# Altium schematic sheet raspi.SchDoc
size A4
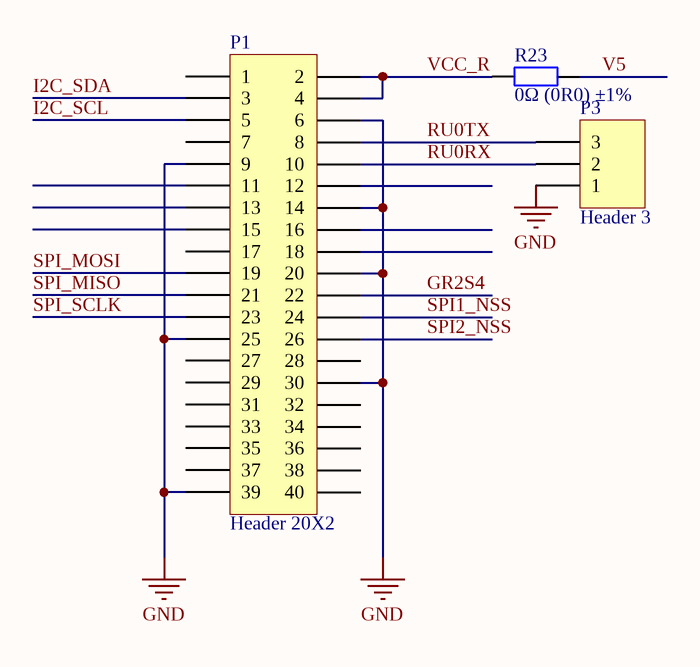
[diagram p0: raspi.SchDoc]

## Parts
P1  Header 20X2  [HDR2X20]
P3  Header 3  [HDR1X3]
R23  0Ω (0R0) ±1%  [1206_R]

## Nets
GND: P1.6 P1.9 P1.14 P1.20 P1.25 P1.30 P1.39 P3.1
GR2S4: P1.22
I2C_SCL: P1.5
I2C_SDA: P1.3
RU0RX: P1.10 P3.2
RU0TX: P1.8 P3.3
SPI1_NSS: P1.24
SPI2_NSS: P1.26
SPI_MISO: P1.21
SPI_MOSI: P1.19
SPI_SCLK: P1.23
V5: R23.2
VCC_R: P1.2 P1.4 R23.1

Not connected (* = marked no-connect by the designer): P1 1 7 11 12 13 15 16 17 18 27 28 29 31 32 33 34 35 36 37 38 40

## Library data of the parts
P1 = Header 20X2: Header, 20-Pin, Dual row; LatestRevisionDate: 17-Jul-2002; LatestRevisionNote: Re-released for DXP Platform.; Publisher: Altium Limited
P3 = Header 3: Header, 3-Pin; LatestRevisionDate: 17-Jul-2002; LatestRevisionNote: Re-released for DXP Platform.; Publisher: Altium Limited
R23 = 1206 0Ω (0R0) 1%: 贴片电阻; ComponentLink1Description: 供应商链接; ComponentLink1URL: http://www.szlcsc.com/product/details_18576.html; Package: 1206; Supplier: LC; SuppliersPartNumber: C17888